# Altium project Pleiades_P01.PrjPcb (part 5 of 10)

## Sheet ADC.SchDoc
size 558 x 431 mm; SheetNumber: 11; SheetTotal: 25; Sheet_Name: ADC; Size: 11x17
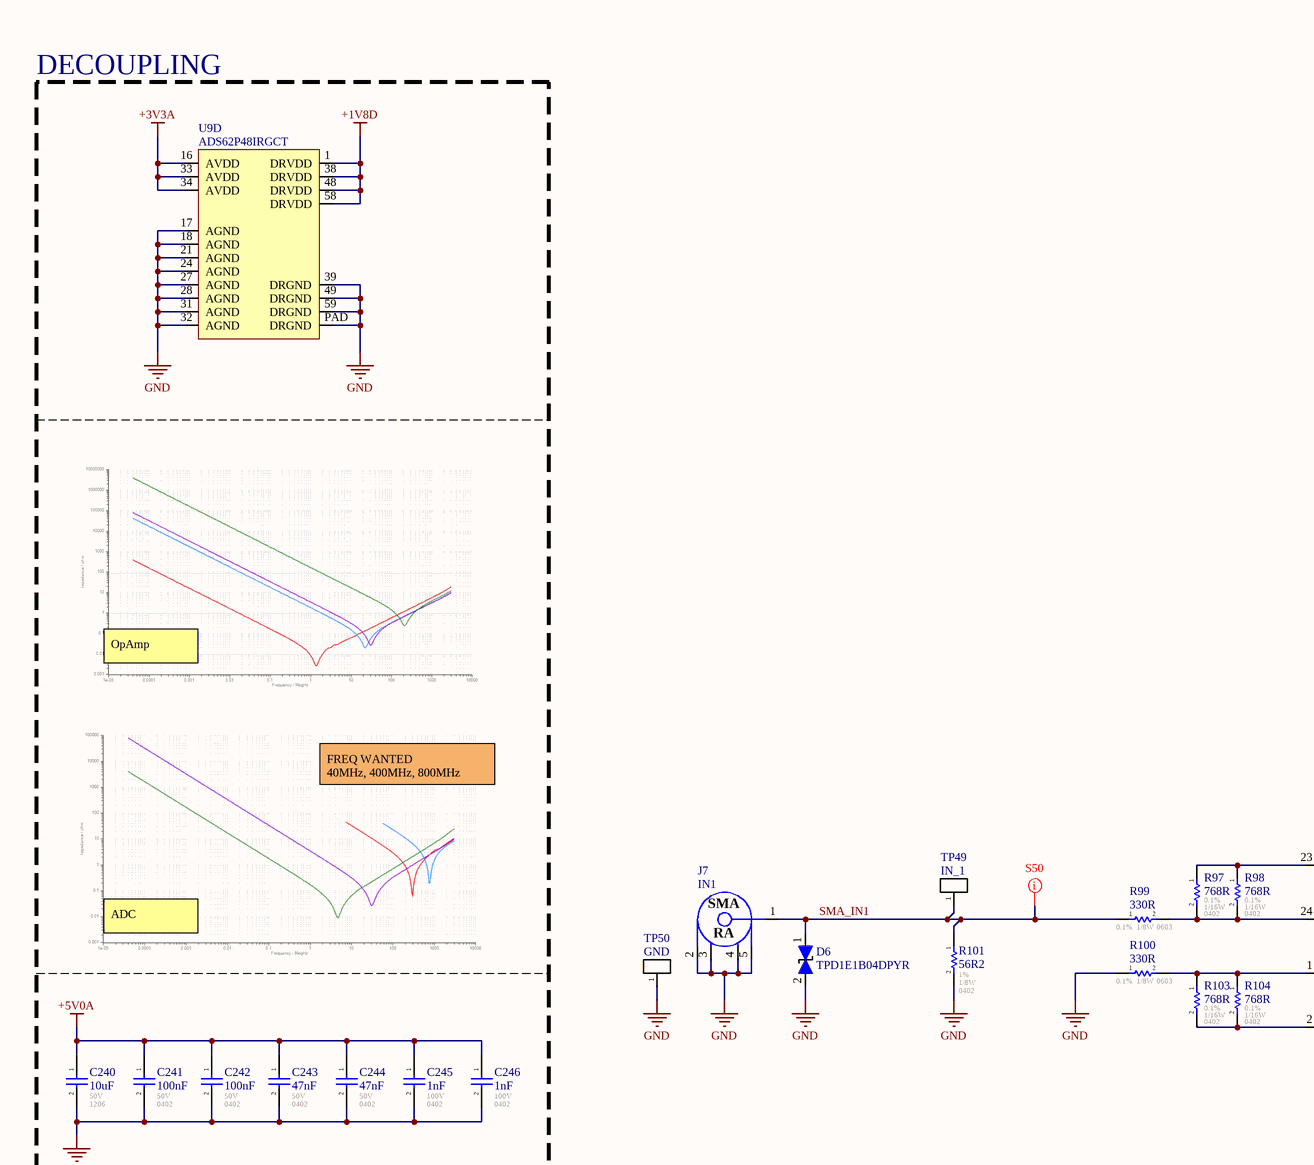
[diagram p26: ADC.SchDoc, top left]
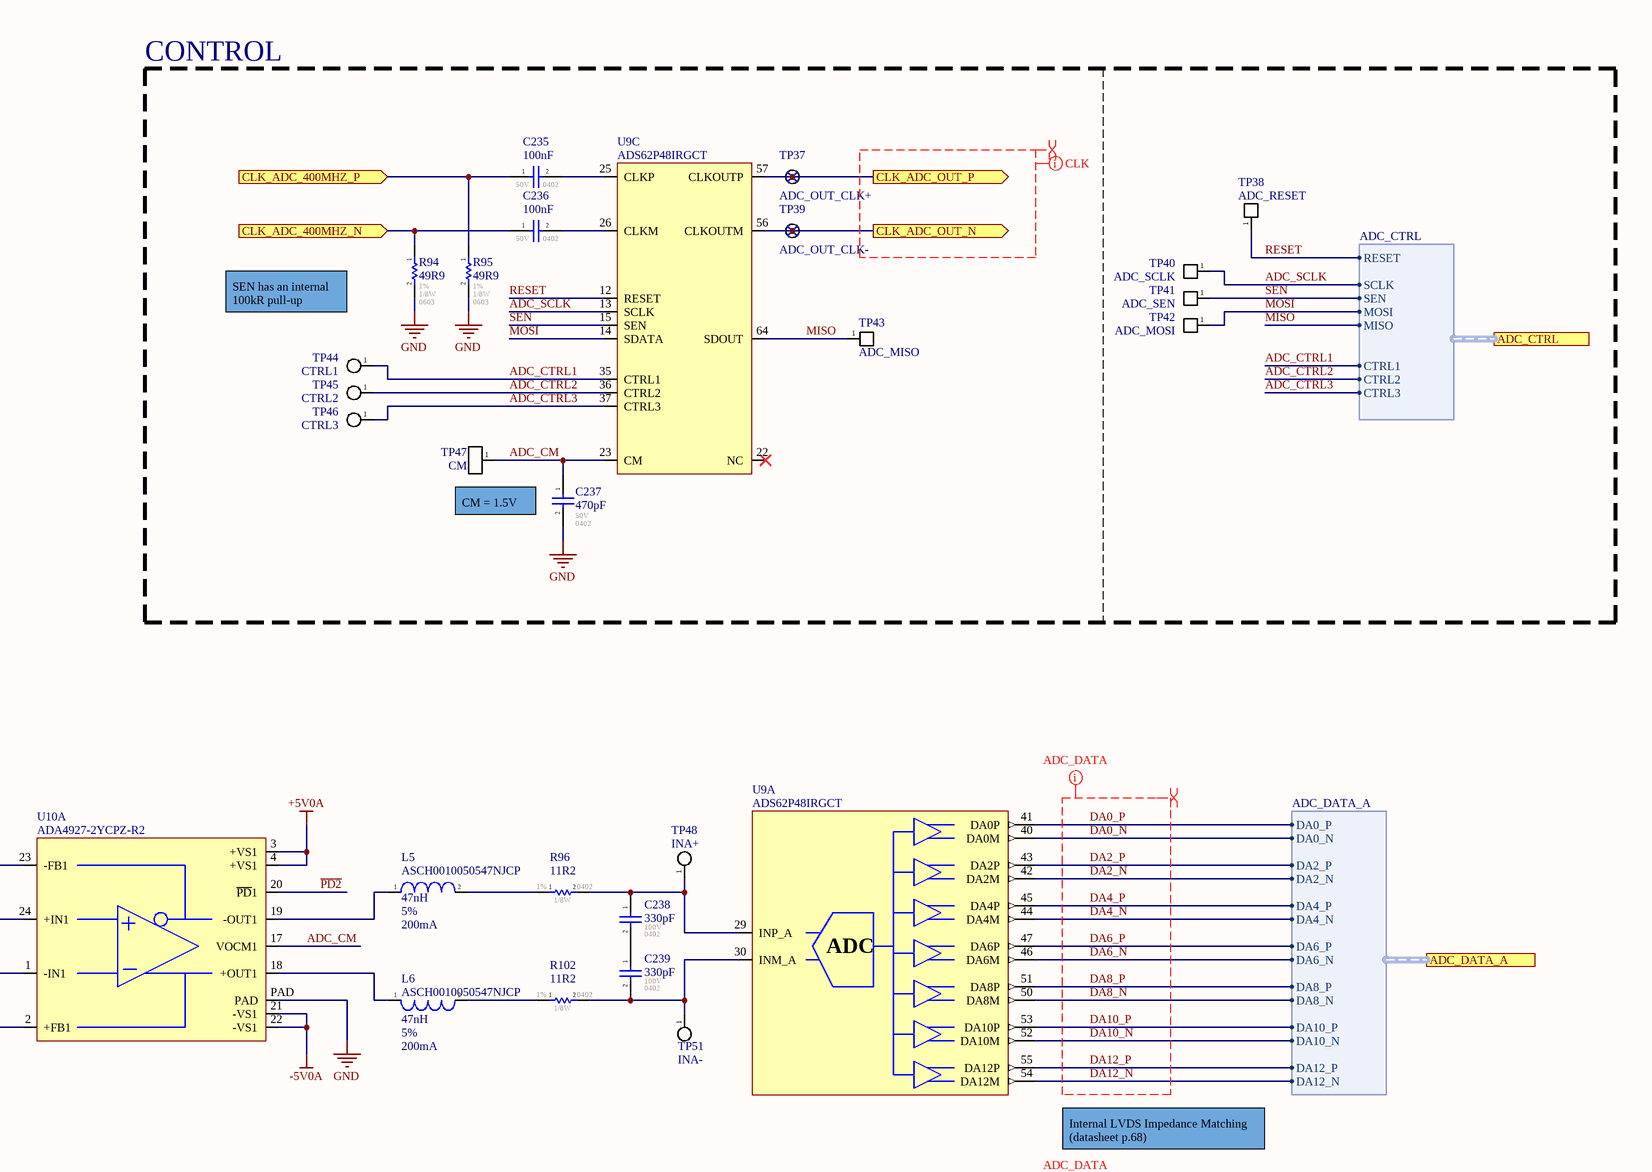
[diagram p27: ADC.SchDoc, top right]
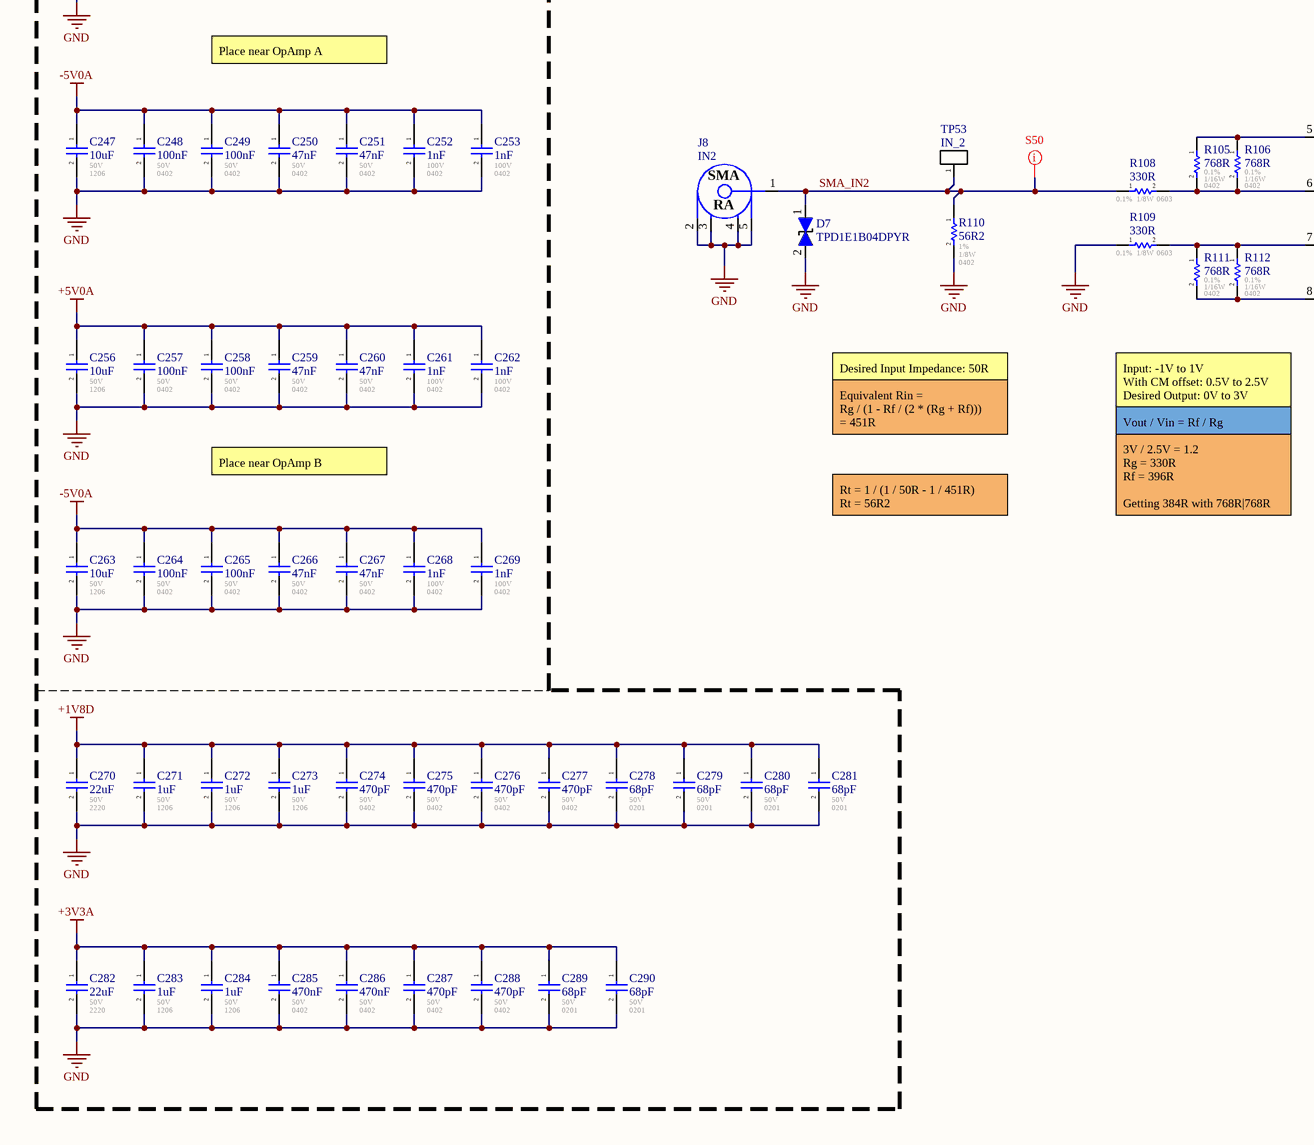
[diagram p28: ADC.SchDoc, bottom left]
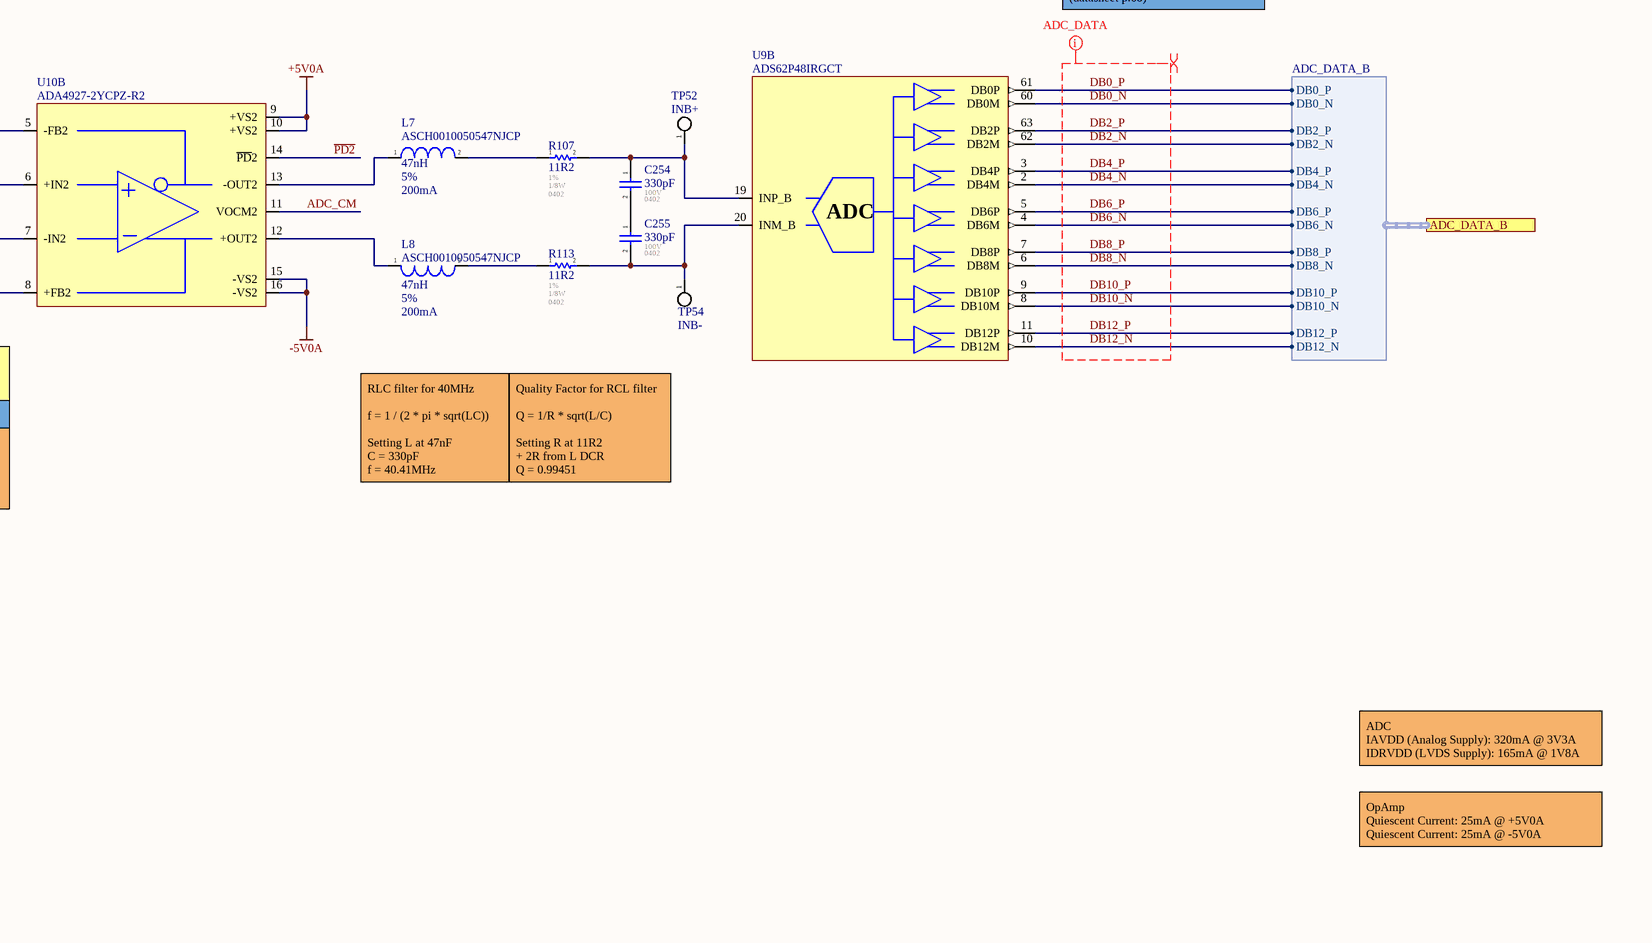
[diagram p29: ADC.SchDoc, bottom right]

### Parts
C235  100nF  Voltage - Rated: 50V  Footprint: 0402  [CAP_0402]
C236  100nF  Voltage - Rated: 50V  Footprint: 0402  [CAP_0402]
C237  470pF  Voltage - Rated: 50V  Footprint: 0402  [CAP_0402]
C238  330pF  Voltage - Rated: 100V  Footprint: 0402  [CAP_0402]
C239  330pF  Voltage - Rated: 100V  Footprint: 0402  [CAP_0402]
C240  10uF  Voltage - Rated: 50V  Footprint: 1206  [CAP_1206]
C241  100nF  Voltage - Rated: 50V  Footprint: 0402  [CAP_0402]
C242  100nF  Voltage - Rated: 50V  Footprint: 0402  [CAP_0402]
C243  47nF  Voltage - Rated: 50V  Footprint: 0402  [CAP_0402]
C244  47nF  Voltage - Rated: 50V  Footprint: 0402  [CAP_0402]
C245  1nF  Voltage - Rated: 100V  Footprint: 0402  [CAP_0402]
C246  1nF  Voltage - Rated: 100V  Footprint: 0402  [CAP_0402]
C247  10uF  Voltage - Rated: 50V  Footprint: 1206  [CAP_1206]
C248  100nF  Voltage - Rated: 50V  Footprint: 0402  [CAP_0402]
C249  100nF  Voltage - Rated: 50V  Footprint: 0402  [CAP_0402]
C250  47nF  Voltage - Rated: 50V  Footprint: 0402  [CAP_0402]
C251  47nF  Voltage - Rated: 50V  Footprint: 0402  [CAP_0402]
C252  1nF  Voltage - Rated: 100V  Footprint: 0402  [CAP_0402]
C253  1nF  Voltage - Rated: 100V  Footprint: 0402  [CAP_0402]
C254  330pF  Voltage - Rated: 100V  Footprint: 0402  [CAP_0402]
C255  330pF  Voltage - Rated: 100V  Footprint: 0402  [CAP_0402]
C256  10uF  Voltage - Rated: 50V  Footprint: 1206  [CAP_1206]
C257  100nF  Voltage - Rated: 50V  Footprint: 0402  [CAP_0402]
C258  100nF  Voltage - Rated: 50V  Footprint: 0402  [CAP_0402]
C259  47nF  Voltage - Rated: 50V  Footprint: 0402  [CAP_0402]
C260  47nF  Voltage - Rated: 50V  Footprint: 0402  [CAP_0402]
C261  1nF  Voltage - Rated: 100V  Footprint: 0402  [CAP_0402]
C262  1nF  Voltage - Rated: 100V  Footprint: 0402  [CAP_0402]
C263  10uF  Voltage - Rated: 50V  Footprint: 1206  [CAP_1206]
C264  100nF  Voltage - Rated: 50V  Footprint: 0402  [CAP_0402]
C265  100nF  Voltage - Rated: 50V  Footprint: 0402  [CAP_0402]
C266  47nF  Voltage - Rated: 50V  Footprint: 0402  [CAP_0402]
C267  47nF  Voltage - Rated: 50V  Footprint: 0402  [CAP_0402]
C268  1nF  Voltage - Rated: 100V  Footprint: 0402  [CAP_0402]
C269  1nF  Voltage - Rated: 100V  Footprint: 0402  [CAP_0402]
C270  22uF  Voltage - Rated: 50V  Footprint: 2220  [CAP_2220]
C271  1uF  Voltage - Rated: 50V  Footprint: 1206  [CAP_1206]
C272  1uF  Voltage - Rated: 50V  Footprint: 1206  [CAP_1206]
C273  1uF  Voltage - Rated: 50V  Footprint: 1206  [CAP_1206]
C274  470pF  Voltage - Rated: 50V  Footprint: 0402  [CAP_0402]
C275  470pF  Voltage - Rated: 50V  Footprint: 0402  [CAP_0402]
C276  470pF  Voltage - Rated: 50V  Footprint: 0402  [CAP_0402]
C277  470pF  Voltage - Rated: 50V  Footprint: 0402  [CAP_0402]
C278  68pF  Voltage - Rated: 50V  Footprint: 0201  [CAP_0402]
C279  68pF  Voltage - Rated: 50V  Footprint: 0201  [CAP_0402]
C280  68pF  Voltage - Rated: 50V  Footprint: 0201  [CAP_0402]
C281  68pF  Voltage - Rated: 50V  Footprint: 0201  [CAP_0402]
C282  22uF  Voltage - Rated: 50V  Footprint: 2220  [CAP_2220]
C283  1uF  Voltage - Rated: 50V  Footprint: 1206  [CAP_1206]
C284  1uF  Voltage - Rated: 50V  Footprint: 1206  [CAP_1206]
C285  470nF  Voltage - Rated: 50V  Footprint: 0402  [CAP_0402]
C286  470nF  Voltage - Rated: 50V  Footprint: 0402  [CAP_0402]
C287  470pF  Voltage - Rated: 50V  Footprint: 0402  [CAP_0402]
C288  470pF  Voltage - Rated: 50V  Footprint: 0402  [CAP_0402]
C289  68pF  Voltage - Rated: 50V  Footprint: 0201  [CAP_0402]
C290  68pF  Voltage - Rated: 50V  Footprint: 0201  [CAP_0402]
D6  TPD1E1B04DPYR  [TVS_DATA_TPD1E1B04DPYR]
D7  TPD1E1B04DPYR  [TVS_DATA_TPD1E1B04DPYR]
J7  IN1  [CONN_SMA_5-1814400-1]
J8  IN2  [CONN_SMA_5-1814400-1]
L5  ASCH0010050547NJCP  Inductance: 47nH  Tolerance: 5%  Current Rating: 200mA  [IND_0402]
L6  ASCH0010050547NJCP  Inductance: 47nH  Tolerance: 5%  Current Rating: 200mA  [IND_0402]
L7  ASCH0010050547NJCP  Inductance: 47nH  Tolerance: 5%  Current Rating: 200mA  [IND_0402]
L8  ASCH0010050547NJCP  Inductance: 47nH  Tolerance: 5%  Current Rating: 200mA  [IND_0402]
R94  49R9  Tolerance: 1%  Power: 1/8W  Package / Case: 0603  [RES_0603]
R95  49R9  Tolerance: 1%  Power: 1/8W  Package / Case: 0603  [RES_0603]
R96  11R2  Tolerance: 1%  Power: 1/8W  Package / Case: 0402  [RES_0402]
R97  768R  Tolerance: 0.1%  Power: 1/16W  Package / Case: 0402  [RES_0402]
R98  768R  Tolerance: 0.1%  Power: 1/16W  Package / Case: 0402  [RES_0402]
R99  330R  Tolerance: 0.1%  Power: 1/8W  Package / Case: 0603  [RES_0603]
R100  330R  Tolerance: 0.1%  Power: 1/8W  Package / Case: 0603  [RES_0603]
R101  56R2  Tolerance: 1%  Power: 1/8W  Package / Case: 0402  [RES_0402]
R102  11R2  Tolerance: 1%  Power: 1/8W  Package / Case: 0402  [RES_0402]
R103  768R  Tolerance: 0.1%  Power: 1/16W  Package / Case: 0402  [RES_0402]
R104  768R  Tolerance: 0.1%  Power: 1/16W  Package / Case: 0402  [RES_0402]
R105  768R  Tolerance: 0.1%  Power: 1/16W  Package / Case: 0402  [RES_0402]
R106  768R  Tolerance: 0.1%  Power: 1/16W  Package / Case: 0402  [RES_0402]
R107  11R2  Tolerance: 1%  Power: 1/8W  Package / Case: 0402  [RES_0402]
R108  330R  Tolerance: 0.1%  Power: 1/8W  Package / Case: 0603  [RES_0603]
R109  330R  Tolerance: 0.1%  Power: 1/8W  Package / Case: 0603  [RES_0603]
R110  56R2  Tolerance: 1%  Power: 1/8W  Package / Case: 0402  [RES_0402]
R111  768R  Tolerance: 0.1%  Power: 1/16W  Package / Case: 0402  [RES_0402]
R112  768R  Tolerance: 0.1%  Power: 1/16W  Package / Case: 0402  [RES_0402]
R113  11R2  Tolerance: 1%  Power: 1/8W  Package / Case: 0402  [RES_0402]
TP37  ADC_OUT_CLK+  [TP_PAD_TINY]  (no BOM)
TP38  ADC_RESET  [TP_PAD]  (no BOM)
TP39  ADC_OUT_CLK-  [TP_PAD_TINY]  (no BOM)
TP40  ADC_SCLK  [TP_PAD]  (no BOM)
TP41  ADC_SEN  [TP_PAD]  (no BOM)
TP42  ADC_MOSI  [TP_PAD]  (no BOM)
TP43  ADC_MISO  [TP_PAD]  (no BOM)
TP44  CTRL1  [TP_PAD_SMALL]  (no BOM)
TP45  CTRL2  [TP_PAD_SMALL]  (no BOM)
TP46  CTRL3  [TP_PAD_SMALL]  (no BOM)
TP47  CM  [TP_HOLE]  (no BOM)
TP48  INA+  [TP_PAD_SMALL]  (no BOM)
TP49  IN_1  [TP_HOLE]  (no BOM)
TP50  GND  [TP_HOLE]  (no BOM)
TP51  INA-  [TP_PAD_SMALL]  (no BOM)
TP52  INB+  [TP_PAD_SMALL]  (no BOM)
TP53  IN_2  [TP_HOLE]  (no BOM)
TP54  INB-  [TP_PAD_SMALL]  (no BOM)
U9  ADS62P48IRGCT  [ADC_ADS62P48IRGCT]  (parts A,B,C,D of 4)
U10  ADA4927-2YCPZ-R2  [OPAMP_ADA4927-2YCPZ-R2]  (parts A,B of 2)

### Blocks framed on the sheet
DECOUPLING: C240-C253 C256-C290 U9
CONTROL: C235-C237 R94 R95 TP37-TP47 U9

### Ports
ADC_CTRL (harness ADC_CTRL), ADC_DATA_A (harness ADC_DATA_A), ADC_DATA_B (harness ADC_DATA_B), CLK_ADC_400MHZ_N (in), CLK_ADC_400MHZ_P (in), CLK_ADC_OUT_N (out), CLK_ADC_OUT_P (out)

### Harnesses
ADC_DATA_A: DA0_P, DA0_N, DA2_P, DA2_N, DA4_P, DA4_N, DA6_P, DA6_N, DA8_P, DA8_N, DA10_P, DA10_N, DA12_P, DA12_N
ADC_DATA_B: DB0_P, DB0_N, DB2_P, DB2_N, DB4_P, DB4_N, DB6_P, DB6_N, DB8_P, DB8_N, DB10_P, DB10_N, DB12_P, DB12_N
ADC_CTRL: RESET, SCLK, SEN, MOSI, MISO, CTRL1, CTRL2, CTRL3

### Nets
+1V8D: C270.1 C271.1 C272.1 C273.1 C274.1 C275.1 C276.1 C277.1 C278.1 C279.1 C280.1 C281.1 U9.1(DRVDD) U9.38(DRVDD) U9.48(DRVDD) U9.58(DRVDD)
+3V3A: C282.1 C283.1 C284.1 C285.1 C286.1 C287.1 C288.1 C289.1 C290.1 U9.16(AVDD) U9.33(AVDD) U9.34(AVDD)
+5V0A: C240.1 C241.1 C242.1 C243.1 C244.1 C245.1 C246.1 C256.1 C257.1 C258.1 C259.1 C260.1 C261.1 C262.1 U10.3(+VS1) U10.4(+VS1) U10.9(+VS2) U10.10(+VS2)
-5V0A: C247.1 C248.1 C249.1 C250.1 C251.1 C252.1 C253.1 C263.1 C264.1 C265.1 C266.1 C267.1 C268.1 C269.1 U10.15(-VS2) U10.16(-VS2) U10.21(-VS1) U10.22(-VS1)
GND: C237.2 C240.2 C241.2 C242.2 C243.2 C244.2 C245.2 C246.2 C247.2 C248.2 C249.2 C250.2 C251.2 C252.2 C253.2 C256.2 C257.2 C258.2 C259.2 C260.2 C261.2 C262.2 C263.2 C264.2 C265.2 C266.2 C267.2 C268.2 C269.2 C270.2 C271.2 C272.2 C273.2 C274.2 C275.2 C276.2 C277.2 C278.2 C279.2 C280.2 C281.2 C282.2 C283.2 C284.2 C285.2 C286.2 C287.2 C288.2 C289.2 C290.2 D6.2(i/o) D7.2(i/o) J7.2 J7.3 J7.4 J7.5 J8.2 J8.3 J8.4 J8.5 R94.2 R95.2 R100.1 R101.2 R109.1 R110.2 TP50.1(A) U9.17(AGND) U9.18(AGND) U9.21(AGND) U9.24(AGND) U9.27(AGND) U9.28(AGND) U9.31(AGND) U9.32(AGND) U9.39(DRGND) U9.49(DRGND) U9.59(DRGND) U9.PAD(DRGND) U10.PAD
~{PD2}: U10.14(~{PD}2) U10.20(~{PD}1)  [project net ~{PD2_11}]
ADC_CM: C237.1 TP47.1(A) U9.23(CM) U10.11(VOCM2) U10.17(VOCM1)  [project net ADC_CM_11]
ADC_CTRL1: TP44.1(A) U9.35(CTRL1) ; port ADC_CTRL.CTRL1
ADC_CTRL2: TP45.1(A) U9.36(CTRL2) ; port ADC_CTRL.CTRL2
ADC_CTRL3: TP46.1(A) U9.37(CTRL3) ; port ADC_CTRL.CTRL3
ADC_SCLK: TP40.1(A) U9.13(SCLK) ; port ADC_CTRL.SCLK
CLK_ADC_400MHZ_N: C236.1 R94.1 ; port CLK_ADC_400MHZ_N
CLK_ADC_400MHZ_P: C235.1 R95.1 ; port CLK_ADC_400MHZ_P
CLK_ADC_OUT_N: TP39.1(A) U9.56(CLKOUTM) ; port CLK_ADC_OUT_N
CLK_ADC_OUT_P: TP37.1(A) U9.57(CLKOUTP) ; port CLK_ADC_OUT_P
DA0_N: U9.40(DA0M) ; port ADC_DATA_A.DA0_N
DA0_P: U9.41(DA0P) ; port ADC_DATA_A.DA0_P
DA2_N: U9.42(DA2M) ; port ADC_DATA_A.DA2_N
DA2_P: U9.43(DA2P) ; port ADC_DATA_A.DA2_P
DA4_N: U9.44(DA4M) ; port ADC_DATA_A.DA4_N
DA4_P: U9.45(DA4P) ; port ADC_DATA_A.DA4_P
DA6_N: U9.46(DA6M) ; port ADC_DATA_A.DA6_N
DA6_P: U9.47(DA6P) ; port ADC_DATA_A.DA6_P
DA8_N: U9.50(DA8M) ; port ADC_DATA_A.DA8_N
DA8_P: U9.51(DA8P) ; port ADC_DATA_A.DA8_P
DA10_N: U9.52(DA10M) ; port ADC_DATA_A.DA10_N
DA10_P: U9.53(DA10P) ; port ADC_DATA_A.DA10_P
DA12_N: U9.54(DA12M) ; port ADC_DATA_A.DA12_N
DA12_P: U9.55(DA12P) ; port ADC_DATA_A.DA12_P
DB0_N: U9.60(DB0M) ; port ADC_DATA_B.DB0_N
DB0_P: U9.61(DB0P) ; port ADC_DATA_B.DB0_P
DB2_N: U9.62(DB2M) ; port ADC_DATA_B.DB2_N
DB2_P: U9.63(DB2P) ; port ADC_DATA_B.DB2_P
DB4_N: U9.2(DB4M) ; port ADC_DATA_B.DB4_N
DB4_P: U9.3(DB4P) ; port ADC_DATA_B.DB4_P
DB6_N: U9.4(DB6M) ; port ADC_DATA_B.DB6_N
DB6_P: U9.5(DB6P) ; port ADC_DATA_B.DB6_P
DB8_N: U9.6(DB8M) ; port ADC_DATA_B.DB8_N
DB8_P: U9.7(DB8P) ; port ADC_DATA_B.DB8_P
DB10_N: U9.8(DB10M) ; port ADC_DATA_B.DB10_N
DB10_P: U9.9(DB10P) ; port ADC_DATA_B.DB10_P
DB12_N: U9.10(DB12M) ; port ADC_DATA_B.DB12_N
DB12_P: U9.11(DB12P) ; port ADC_DATA_B.DB12_P
MISO: TP43.1(A) U9.64(SDOUT) ; port ADC_CTRL.MISO
MOSI: TP42.1(A) U9.14(SDATA) ; port ADC_CTRL.MOSI
RESET: TP38.1(A) U9.12(RESET) ; port ADC_CTRL.RESET
SEN: TP41.1(A) U9.15(SEN) ; port ADC_CTRL.SEN
SMA_IN1: D6.1(i/o) J7.1 R99.1 R101.1 TP49.1(A)  [project net SMA_IN1_11]
SMA_IN2: D7.1(i/o) J8.1 R108.1 R110.1 TP53.1(A)  [project net SMA_IN2_11]
NetC235_2: C235.2 U9.25(CLKP)
NetC236_2: C236.2 U9.26(CLKM)
NetC238_1: C238.1 R96.2 TP48.1(A) U9.29(INP_A)
NetC238_2: C238.2 C239.1
NetC239_2: C239.2 R102.2 TP51.1(A) U9.30(INM_A)
NetC254_1: C254.1 R107.2 TP52.1(A) U9.19(INP_B)
NetC254_2: C254.2 C255.1
NetC255_2: C255.2 R113.2 TP54.1(A) U9.20(INM_B)
NetL5_1: L5.1 U10.19(-OUT1)
NetL5_2: L5.2 R96.1
NetL6_1: L6.1 U10.18(+OUT1)
NetL6_2: L6.2 R102.1
NetL7_1: L7.1 U10.13(-OUT2)
NetL7_2: L7.2 R107.1
NetL8_1: L8.1 U10.12(+OUT2)
NetL8_2: L8.2 R113.1
NetR97_1: R97.1 R98.1 U10.23(-FB1)
NetR97_2: R97.2 R98.2 R99.2 U10.24(+IN1)
NetR100_2: R100.2 R103.1 R104.1 U10.1(-IN1)
NetR103_2: R103.2 R104.2 U10.2(+FB1)
NetR105_1: R105.1 R106.1 U10.5(-FB2)
NetR105_2: R105.2 R106.2 R108.2 U10.6(+IN2)
NetR109_2: R109.2 R111.1 R112.1 U10.7(-IN2)
NetR111_2: R111.2 R112.2 U10.8(+FB2)

Not connected (* = marked no-connect by the designer): U9 22(NC)*

### Layout directives
net class CLK; net class ADC_DATA: (no net found under the mark)
differential pair: (no net found under the mark), DA0_N, DA0_P, DA2_N, DA2_P, DA4_N, DA4_P, DA6_N, DA6_P, DA8_N, DA8_P, DA10_N, DA10_P, DA12_N, DA12_P, DB0_N, DB0_P, DB2_N, DB2_P, DB4_N, DB4_P, DB6_N, DB6_P, DB8_N, DB8_P, DB10_N, DB10_P, DB12_N, DB12_P
net class S50: SMA_IN1_11, SMA_IN2_11
net class ADC_DATA: DA0_N, DA0_P, DA2_N, DA2_P, DA4_N, DA4_P, DA6_N, DA6_P, DA8_N, DA8_P, DA10_N, DA10_P, DA12_N, DA12_P, DB0_N, DB0_P, DB2_N, DB2_P, DB4_N, DB4_P, DB6_N, DB6_P, DB8_N, DB8_P, DB10_N, DB10_P, DB12_N, DB12_P

### Notes on the sheet
- SEN has an internal 100kR pull-up
- CM = 1.5V
- OpAmp
- FREQ WANTED
  40MHz, 400MHz, 800MHz
- ADC
- Internal LVDS Impedance Matching
  (datasheet p.68)
- Place near OpAmp A
- Desired Input Impedance: 50R
- Equivalent Rin =
  Rg / (1 - Rf / (2 * (Rg + Rf)))
  = 451R
- Input: -1V to 1V
  With CM offset: 0.5V to 2.5V
  Desired Output: 0V to 3V
- Vout / Vin = Rf / Rg
- Place near OpAmp B
- Rt = 1 / (1 / 50R - 1 / 451R)
  Rt = 56R2
- 3V / 2.5V = 1.2
  Rg = 330R
  Rf = 396R
  Getting 384R with 768R|768R
- RLC filter for 40MHz
  f = 1 / (2 * pi * sqrt(LC))
  Setting L at 47nF
  C = 330pF
  f = 40.41MHz
- Quality Factor for RCL filter
  Q = 1/R * sqrt(L/C)
  Setting R at 11R2
  + 2R from L DCR
  Q = 0.99451
- ADC
  IAVDD (Analog Supply): 320mA @ 3V3A
  IDRVDD (LVDS Supply): 165mA @ 1V8A
- OpAmp
  Quiescent Current: 25mA @ +5V0A
  Quiescent Current: 25mA @ -5V0A
- Sheet Name
- Project Title
- Global Project
- Revision
- Size
- Date
- Group
- Sheet
- of
- Filename
- Designers
- (in symbol ADC_ADS62P48IRGCT, part A) ADC
- (in symbol ADC_ADS62P48IRGCT, part B) ADC
- (in symbol CONN_SMA_5-1814400-1) SMA; RA

### Library data of the parts
C235 C236 C241 C242 C248 C249 C257 C258 C264 C265 = CAP_CER: GCM155R71H104KE02J / 0402 100nF 10% X7R Ceramic Capacitor; Mfr: Murata; Operating Temperature: -55C - 125C; Temperature Coefficient: X7R; ComponentLink1Description: Digikey; ComponentLink1URL: [Digikey Link]; Part#: GCM155R71H104KE02J; ComponentLink2Description: Datasheet; ComponentLink2URL: [Datasheet Link]; Tolerance: 10%; Ratings: AEC-Q200
C237 C274-C277 C287 C288 = CAP_CER: GCM155R71H471KA37J / 0402 470pF 10% X7R Ceramic Capacitor; Mfr: Murata; Operating Temperature: -55C - 125C; Temperature Coefficient: X7R; ComponentLink1Description: Digikey; ComponentLink1URL: https://www.digikey.ca/en/products/detail/murata-electronics/GCM155R71H471KA37J/2591324; Part#: GCM155R71H471KA37J; ComponentLink2Description: Datasheet; ComponentLink2URL: https://search.murata.co.jp/Ceramy/image/img/A01X/G101/ENG/GCM155R71H471KA37-01A.pdf; Tolerance: 10%; Ratings: AEC-Q200; ComponentLink3Description: Murata; ComponentLink3URL: https://www.murata.com/en-us/products/productdetail?partno=GCM155R71H471KA37%23; ComponentLink4Description: Octopart; ComponentLink4URL: https://octopart.com/gcm155r71h471ka37j-murata-17803389?r=sp
C238 C239 C254 C255 = CAP_CER: GCM155R72A331KA37D / 0402 330pF 10% X7R Ceramic Capacitor; Mfr: Murata; Operating Temperature: -55C - 125C; Temperature Coefficient: X7R; ComponentLink1Description: Digikey; ComponentLink1URL: https://www.digikey.ca/en/products/detail/murata-electronics/GCM155R72A331KA37D/2591348; Part#: GCM155R72A331KA37D; ComponentLink2Description: Datasheet; ComponentLink2URL: https://search.murata.co.jp/Ceramy/image/img/A01X/G101/ENG/GCM155R72A331KA37-01A.pdf; Tolerance: 10%; Ratings: AEC-Q200; ComponentLink3Description: Murata; ComponentLink3URL: https://www.murata.com/en-us/products/productdetail?partno=GCM155R72A331KA37%23; ComponentLink4Description: Octopart; ComponentLink4URL: https://octopart.com/gcm155r72a331ka37d-murata-18331888?r=sp; Supplier 1: Arrow Electronics; Supplier Part Number 1: GCM155R72A331KA37D
C240 C247 C256 C263 = CAP_CER: GRT31CR61H106KE01L / 1206 10uF 10% X5R Ceramic Capacitor; Mfr: Murata; Operating Temperature: -55C - 85C; Temperature Coefficient: X5R; ComponentLink1Description: Digikey; ComponentLink1URL: [Digikey Link]; ComponentLink2Description: Datasheet; ComponentLink2URL: [Datasheet Link]; Tolerance: 10%; Ratings: AEC-Q200; Supplier 1: Arrow Electronics; Supplier Part Number 1: GRT31CR61H106KE01L; Part#: GRT31CR61H106KE01L
C243 C244 C250 C251 C259 C260 C266 C267 = CAP_CER: GCM155R71H473KE02J / 0402 47nF 10% X7R Ceramic Capacitor; Mfr: Murata; Operating Temperature: -55C - 125C; Temperature Coefficient: X7R; ComponentLink1Description: Digikey; ComponentLink1URL: [Digikey Link]; Part#: GCM155R71H473KE02J; ComponentLink2Description: Datasheet; ComponentLink2URL: [Datasheet Link]; Tolerance: 10%; Ratings: AEC-Q200
C245 C246 C252 C253 C261 C262 C268 C269 = CAP_CER: as C206-C210 on sheet PROM; Operating Temperature: -55C - 125C; Temperature Coefficient: X7R; ComponentLink1Description: Digikey; ComponentLink1URL: [Digikey Link]; Part#: GCM155R72A102KA37D; ComponentLink2Description: Datasheet; ComponentLink2URL: [Datasheet Link]; Tolerance: 10%; Ratings: AEC-Q200
C270 C282 = CAP_CER: CGA9P3X7R1H226M250KB / 2220 22uF 20% X7R Ceramic Capacitor; Mfr: TDK; Operating Temperature: -55C - 125C; Temperature Coefficient: X7R; ComponentLink1Description: Digikey; ComponentLink1URL: https://www.digikey.ca/en/products/detail/tdk-corporation/CGA9P3X7R1H226M250KB/10240627; ComponentLink2Description: Datasheet; ComponentLink2URL: https://product.tdk.com/system/files/dam/doc/product/capacitor/ceramic/mlcc/charasheet/cga9p3x7r1h226m250kb.pdf; Tolerance: 20%; Ratings: AEC-Q200; Part#: CGA9P3X7R1H226M250KB; Supplier 1: Arrow Electronics; Supplier Part Number 1: CGA9P3X7R1H226M250KB; ComponentLink3Description: TDK; ComponentLink3URL: https://product.tdk.com/en/search/capacitor/ceramic/mlcc/info?part_no=CGA9P3X7R1H226M250KB; ComponentLink4Description: Octopart; ComponentLink4URL: https://octopart.com/cga9p3x7r1h226m250kb-tdk-102764996?r=sp
C271-C273 C283 C284 = CAP_CER: GCJ31CR71H105KA12L / 1206 1uF 10% X7R Ceramic Capacitor; Mfr: Murata; Operating Temperature: -55C - 125C; Temperature Coefficient: X7R; ComponentLink1Description: Digikey; ComponentLink1URL: [Digikey Link]; Part#: GCJ31CR71H105KA12L; ComponentLink2Description: Datasheet; ComponentLink2URL: [Datasheet Link]; Tolerance: 10%; Ratings: AEC-Q200
C278-C281 C289 C290 = CAP_CER: 0201 68pF 5% C0G 50V Ceramic Capacitor / CGA1A2C0G1H680J030BA; Mfr: TDK; Operating Temperature: -55C - 125C; Temperature Coefficient: C0G; ComponentLink1Description: Digikey; ComponentLink1URL: https://www.digikey.ca/en/products/detail/tdk-corporation/CGA1A2C0G1H680J030BA/3648597; Part#: CGA1A2C0G1H680J030BA; ComponentLink2Description: Datasheet; ComponentLink2URL: https://product.tdk.com/system/files/dam/doc/product/capacitor/ceramic/mlcc/charasheet/cga1a2c0g1h680j030ba.pdf; Tolerance: 5%; Ratings: AEC-Q200; ComponentLink3Description: Octopart; ComponentLink3URL: https://octopart.com/cga1a2c0g1h680j030ba-tdk-26014371?r=sp; ComponentLink4Description: TDK; ComponentLink4URL: https://product.tdk.com/en/search/capacitor/ceramic/mlcc/info?part_no=CGA1A2C0G1H680J030BA; Supplier 1: Arrow Electronics; Supplier Part Number 1: CGA1A2C0G1H680J030BA
C285 C286 = CAP_CER: CGA3E3X7R1H474K080AB / 0603 470nF 10% X7R Ceramic Capacitor; Mfr: TDK; Operating Temperature: -55C - 125C; Temperature Coefficient: X7R; ComponentLink1Description: Digikey; ComponentLink1URL: [Digikey Link]; Part#: CGA3E3X7R1H474K080AB; ComponentLink2Description: Datasheet; ComponentLink2URL: [Datasheet Link]; Tolerance: 10%; Ratings: AEC-Q200
D6 D7 = TVS_DATA_TPD1E1B04DPYR: TVS - TVS DIODE 3.6V 8.5V - 0402; Manufacturer #1: Texas Instruments; Current Rating: 6.3Apeak; Power Max: 50Wpeak; GRAMS Lib Spec: 2.8; Magnetic Material: Unknown; Polarized: No; Value: *; Tolerance: *; Voltage Rating: 3.6V; HelpURL: http://www.ti.com/lit/ds/symlink/tpd1e1b04.pdf; CreatedBy/Date: Keven Deslandes - 2018/10/19; VerifiedBy: Caroline Paulin - 28 janv 2019; Temperature: -40°C ~ 125°C (TA); Package: 0402; Manufacturer #2: *; Note: *; Assembly Type: SMD; Part Number #2: *; Part Number #1: TPD1E1B04DPYR; Supplier 1: Digi-Key; Supplier Part Number 1: 296-47364-1-ND; Cryo: UNKNOWN
J7 J8 = CONN_SMA_5-1814400-1: 5-1814400-1 / CONN -  SMA JACK R/A 50 OHM - TH; Mfg: TE Connectivity AMP Connectors; Voltage: *; Current: *; Power: *; Mfg Part Number: 5-1814400-1; HelpURL: http://www.te.com/commerce/DocumentDelivery/DDEController?Action=srchrtrv&DocNm=1814400&DocType=Customer+Drawing&DocLang=English; CreatedBy: Jonathan Bouchard; Temperature: -55°C ~ 85°C; Value: *; Precision: *; Package: TH-5; Supplier 1: Digikey; Supplier Part Number 1: A97593-ND
L5-L8 = INDUCTOR: Generic Inductor; Material: Ceramic; Resistance: 2R; Q @ Freq: 8 @ 100MHz; Operating Temperature: -40C - 125C; Package / Case: 0402; Ratings: AEC-Q200; ComponentLink1Description: Digikey; ComponentLink1URL: https://www.digikey.ca/en/products/detail/pulse-electronics/asch0010050547njcp/16505828; ComponentLink2Description: Datasheet; ComponentLink2URL: https://productfinder.pulseelectronics.com/api/open/part-attachments/datasheet/ASCH0010050547NJCP; ComponentLink3Description: Octopart; ComponentLink3URL: https://octopart.com/asch0010050547njcp-pulse-128075783?r=sp; Supplier 1: Mouser; Supplier Part Number 1: 673-ASCH10050547NJCP
R94-R98 R101-R107 R110-R113 = RESISTOR: Automotive: AEC-Q200; Operating Temperature: *; # Digikey: *; ComponentLink1Description: Digikey; ComponentLink1URL: *; # Manufacturer: *
R99 R100 R108 R109 = RESISTOR: 1M 0603 1% 1/16W Resistor; Automotive: AEC-Q200; Operating Temperature: *; # Digikey: *; ComponentLink1Description: Digikey; ComponentLink1URL: *; # Manufacturer: *
TP37 TP39 = TESTPOINT_PAD_TINY: Test Point
TP38 TP40-TP43 = TESTPOINT_PAD: Test Point
TP44-TP46 TP48 TP51 TP52 TP54 = TESTPOINT_PAD_SMALL: Test Point
TP47 TP49 TP50 TP53 = TESTPOINT: Test Point; ClassName: Testpoint
U9 = ADC_ADS62P48IRGCT: ADC - 14 BIT 210MSPS SUAL - VQFN-64; Voltage: 3.15 V ~ 3.6 V / 1.7 V ~ 1.9 V; Mfg: Texas Instruments; Precision: 14 Bit; Current: *; Power: *; Mfg Part Number: ADS62P48IRGCT; HelpURL: http://www.ti.com/lit/ds/symlink/ads62p48.pdf; CreatedBy: Jonathan Bouchard; Temperature: -40°C ~ 85°C; Value: *; Package: VQFN-64; Supplier 1: Digikey; Supplier Part Number 1: 296-24611-1-ND
U10 = OPAMP_ADA4927-2YCPZ-R2: OPAMP - CFA 2.3GHZ - QFN-24; Voltage: 4.5 V ~ 11 V, ±2.25 V ~ 5.5 V; Current: 65mA; Mfg: Analog Devices; Power: *; Mfg Part Number: ADA4927-2YCPZ-R2; HelpURL: http://www.analog.com/media/en/technical-documentation/data-sheets/ADA4927-1_4927-2.pdf; CreatedBy: Jonathan Bouchard; Temperature: -40°C ~ 105°C; Value: *; Precision: *; Package: QFN-24; Supplier 1: Digikey; Supplier Part Number 1: ADA4927-2YCPZ-R2CT-ND

## Sheet DAC.SchDoc
size 558 x 431 mm; SheetNumber: 12; SheetTotal: 25; Sheet_Name: DAC; Size: 11x17
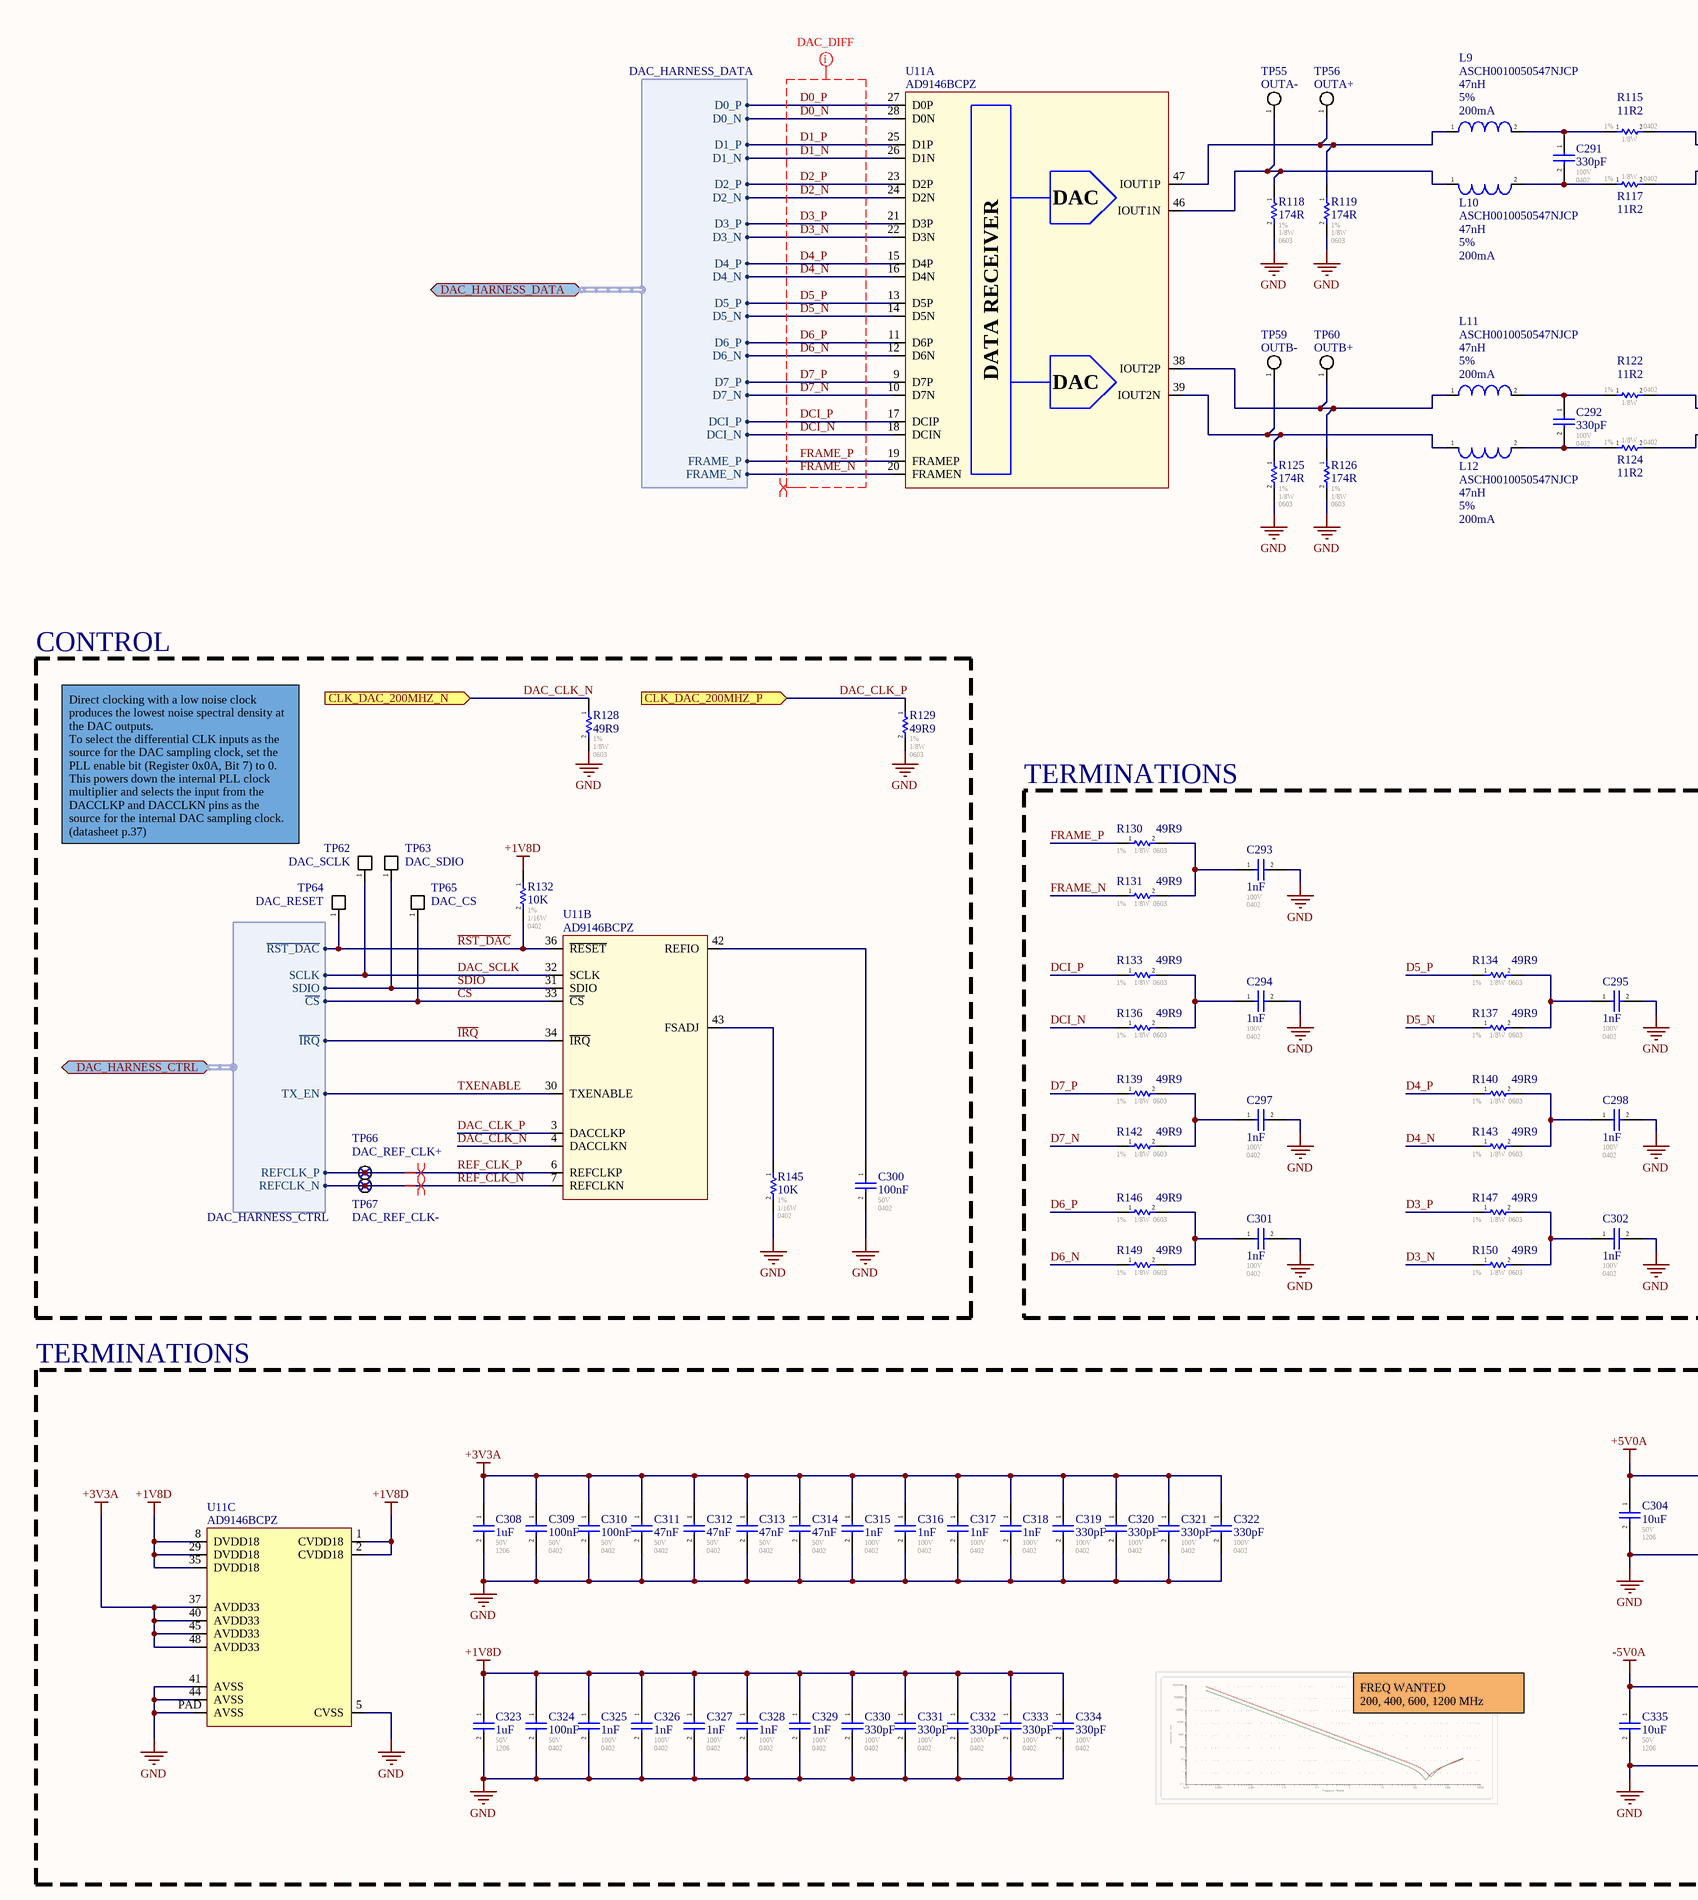
[diagram p30: DAC.SchDoc, left]
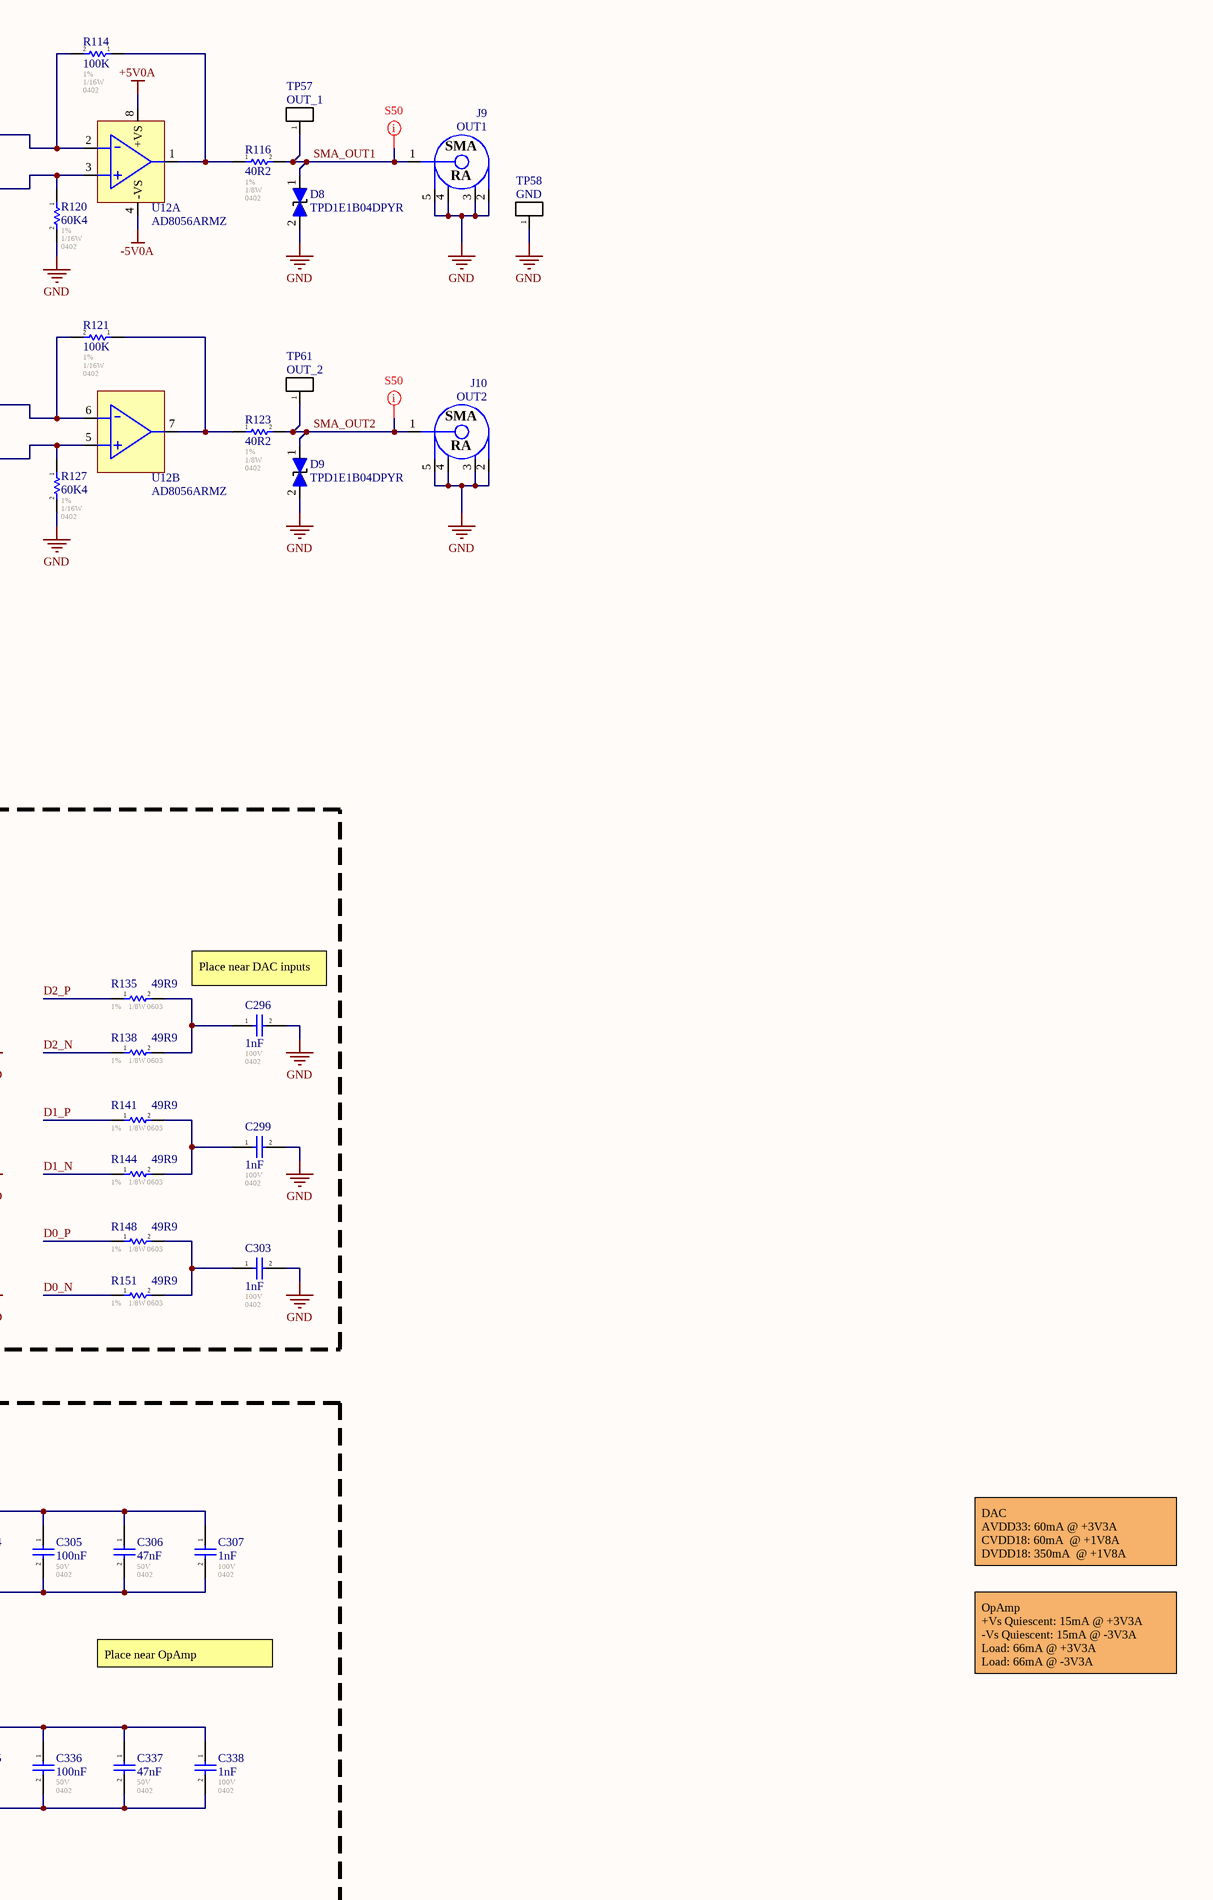
[diagram p31: DAC.SchDoc, right]

### Parts
C291  330pF  Voltage - Rated: 100V  Footprint: 0402  [CAP_0402]
C292  330pF  Voltage - Rated: 100V  Footprint: 0402  [CAP_0402]
C293  1nF  Voltage - Rated: 100V  Footprint: 0402  [CAP_0402]
C294  1nF  Voltage - Rated: 100V  Footprint: 0402  [CAP_0402]
C295  1nF  Voltage - Rated: 100V  Footprint: 0402  [CAP_0402]
C296  1nF  Voltage - Rated: 100V  Footprint: 0402  [CAP_0402]
C297  1nF  Voltage - Rated: 100V  Footprint: 0402  [CAP_0402]
C298  1nF  Voltage - Rated: 100V  Footprint: 0402  [CAP_0402]
C299  1nF  Voltage - Rated: 100V  Footprint: 0402  [CAP_0402]
C300  100nF  Voltage - Rated: 50V  Footprint: 0402  [CAP_0402]
C301  1nF  Voltage - Rated: 100V  Footprint: 0402  [CAP_0402]
C302  1nF  Voltage - Rated: 100V  Footprint: 0402  [CAP_0402]
C303  1nF  Voltage - Rated: 100V  Footprint: 0402  [CAP_0402]
C304  10uF  Voltage - Rated: 50V  Footprint: 1206  [CAP_1206]
C305  100nF  Voltage - Rated: 50V  Footprint: 0402  [CAP_0402]
C306  47nF  Voltage - Rated: 50V  Footprint: 0402  [CAP_0402]
C307  1nF  Voltage - Rated: 100V  Footprint: 0402  [CAP_0402]
C308  1uF  Voltage - Rated: 50V  Footprint: 1206  [CAP_1206]
C309  100nF  Voltage - Rated: 50V  Footprint: 0402  [CAP_0402]
C310  100nF  Voltage - Rated: 50V  Footprint: 0402  [CAP_0402]
C311  47nF  Voltage - Rated: 50V  Footprint: 0402  [CAP_0402]
C312  47nF  Voltage - Rated: 50V  Footprint: 0402  [CAP_0402]
C313  47nF  Voltage - Rated: 50V  Footprint: 0402  [CAP_0402]
C314  47nF  Voltage - Rated: 50V  Footprint: 0402  [CAP_0402]
C315  1nF  Voltage - Rated: 100V  Footprint: 0402  [CAP_0402]
C316  1nF  Voltage - Rated: 100V  Footprint: 0402  [CAP_0402]
C317  1nF  Voltage - Rated: 100V  Footprint: 0402  [CAP_0402]
C318  1nF  Voltage - Rated: 100V  Footprint: 0402  [CAP_0402]
C319  330pF  Voltage - Rated: 100V  Footprint: 0402  [CAP_0402]
C320  330pF  Voltage - Rated: 100V  Footprint: 0402  [CAP_0402]
C321  330pF  Voltage - Rated: 100V  Footprint: 0402  [CAP_0402]
C322  330pF  Voltage - Rated: 100V  Footprint: 0402  [CAP_0402]
C323  1uF  Voltage - Rated: 50V  Footprint: 1206  [CAP_1206]
C324  100nF  Voltage - Rated: 50V  Footprint: 0402  [CAP_0402]
C325  1nF  Voltage - Rated: 100V  Footprint: 0402  [CAP_0402]
C326  1nF  Voltage - Rated: 100V  Footprint: 0402  [CAP_0402]
C327  1nF  Voltage - Rated: 100V  Footprint: 0402  [CAP_0402]
C328  1nF  Voltage - Rated: 100V  Footprint: 0402  [CAP_0402]
C329  1nF  Voltage - Rated: 100V  Footprint: 0402  [CAP_0402]
C330  330pF  Voltage - Rated: 100V  Footprint: 0402  [CAP_0402]
C331  330pF  Voltage - Rated: 100V  Footprint: 0402  [CAP_0402]
C332  330pF  Voltage - Rated: 100V  Footprint: 0402  [CAP_0402]
C333  330pF  Voltage - Rated: 100V  Footprint: 0402  [CAP_0402]
C334  330pF  Voltage - Rated: 100V  Footprint: 0402  [CAP_0402]
C335  10uF  Voltage - Rated: 50V  Footprint: 1206  [CAP_1206]
C336  100nF  Voltage - Rated: 50V  Footprint: 0402  [CAP_0402]
C337  47nF  Voltage - Rated: 50V  Footprint: 0402  [CAP_0402]
C338  1nF  Voltage - Rated: 100V  Footprint: 0402  [CAP_0402]
D8  TPD1E1B04DPYR  [TVS_DATA_TPD1E1B04DPYR]
D9  TPD1E1B04DPYR  [TVS_DATA_TPD1E1B04DPYR]
J9  OUT1  [CONN_SMA_5-1814400-1]
J10  OUT2  [CONN_SMA_5-1814400-1]
L9  ASCH0010050547NJCP  Inductance: 47nH  Tolerance: 5%  Current Rating: 200mA  [IND_0402]
L10  ASCH0010050547NJCP  Inductance: 47nH  Tolerance: 5%  Current Rating: 200mA  [IND_0402]
L11  ASCH0010050547NJCP  Inductance: 47nH  Tolerance: 5%  Current Rating: 200mA  [IND_0402]
L12  ASCH0010050547NJCP  Inductance: 47nH  Tolerance: 5%  Current Rating: 200mA  [IND_0402]
R114  100K  Tolerance: 1%  Power: 1/16W  Package / Case: 0402  [RES_0402]
R115  11R2  Tolerance: 1%  Power: 1/8W  Package / Case: 0402  [RES_0402]
R116  40R2  Tolerance: 1%  Power: 1/8W  Package / Case: 0402  [RES_0402]
R117  11R2  Tolerance: 1%  Power: 1/8W  Package / Case: 0402  [RES_0402]
R118  174R  Tolerance: 1%  Power: 1/8W  Package / Case: 0603  [RES_0603]
R119  174R  Tolerance: 1%  Power: 1/8W  Package / Case: 0603  [RES_0603]
R120  60K4  Tolerance: 1%  Power: 1/16W  Package / Case: 0402  [RES_0402]
R121  100K  Tolerance: 1%  Power: 1/16W  Package / Case: 0402  [RES_0402]
R122  11R2  Tolerance: 1%  Power: 1/8W  Package / Case: 0402  [RES_0402]
R123  40R2  Tolerance: 1%  Power: 1/8W  Package / Case: 0402  [RES_0402]
R124  11R2  Tolerance: 1%  Power: 1/8W  Package / Case: 0402  [RES_0402]
R125  174R  Tolerance: 1%  Power: 1/8W  Package / Case: 0603  [RES_0603]
R126  174R  Tolerance: 1%  Power: 1/8W  Package / Case: 0603  [RES_0603]
R127  60K4  Tolerance: 1%  Power: 1/16W  Package / Case: 0402  [RES_0402]
R128  49R9  Tolerance: 1%  Power: 1/8W  Package / Case: 0603  [RES_0603]
R129  49R9  Tolerance: 1%  Power: 1/8W  Package / Case: 0603  [RES_0603]
R130  49R9  Tolerance: 1%  Power: 1/8W  Package / Case: 0603  [RES_0603]
R131  49R9  Tolerance: 1%  Power: 1/8W  Package / Case: 0603  [RES_0603]
R132  10K  Tolerance: 1%  Power: 1/16W  Package / Case: 0402  [RES_0402]
R133  49R9  Tolerance: 1%  Power: 1/8W  Package / Case: 0603  [RES_0603]
R134  49R9  Tolerance: 1%  Power: 1/8W  Package / Case: 0603  [RES_0603]
R135  49R9  Tolerance: 1%  Power: 1/8W  Package / Case: 0603  [RES_0603]
R136  49R9  Tolerance: 1%  Power: 1/8W  Package / Case: 0603  [RES_0603]
R137  49R9  Tolerance: 1%  Power: 1/8W  Package / Case: 0603  [RES_0603]
R138  49R9  Tolerance: 1%  Power: 1/8W  Package / Case: 0603  [RES_0603]
R139  49R9  Tolerance: 1%  Power: 1/8W  Package / Case: 0603  [RES_0603]
R140  49R9  Tolerance: 1%  Power: 1/8W  Package / Case: 0603  [RES_0603]
R141  49R9  Tolerance: 1%  Power: 1/8W  Package / Case: 0603  [RES_0603]
R142  49R9  Tolerance: 1%  Power: 1/8W  Package / Case: 0603  [RES_0603]
R143  49R9  Tolerance: 1%  Power: 1/8W  Package / Case: 0603  [RES_0603]
R144  49R9  Tolerance: 1%  Power: 1/8W  Package / Case: 0603  [RES_0603]
R145  10K  Tolerance: 1%  Power: 1/16W  Package / Case: 0402  [RES_0402]
R146  49R9  Tolerance: 1%  Power: 1/8W  Package / Case: 0603  [RES_0603]
R147  49R9  Tolerance: 1%  Power: 1/8W  Package / Case: 0603  [RES_0603]
R148  49R9  Tolerance: 1%  Power: 1/8W  Package / Case: 0603  [RES_0603]
R149  49R9  Tolerance: 1%  Power: 1/8W  Package / Case: 0603  [RES_0603]
R150  49R9  Tolerance: 1%  Power: 1/8W  Package / Case: 0603  [RES_0603]
R151  49R9  Tolerance: 1%  Power: 1/8W  Package / Case: 0603  [RES_0603]
TP55  OUTA-  [TP_PAD_SMALL]  (no BOM)
TP56  OUTA+  [TP_PAD_SMALL]  (no BOM)
TP57  OUT_1  [TP_HOLE]  (no BOM)
TP58  GND  [TP_HOLE]  (no BOM)
TP59  OUTB-  [TP_PAD_SMALL]  (no BOM)
TP60  OUTB+  [TP_PAD_SMALL]  (no BOM)
TP61  OUT_2  [TP_HOLE]  (no BOM)
TP62  DAC_SCLK  [TP_PAD]  (no BOM)
TP63  DAC_SDIO  [TP_PAD]  (no BOM)
TP64  DAC_RESET  [TP_PAD]  (no BOM)
TP65  DAC_CS  [TP_PAD]  (no BOM)
TP66  DAC_REF_CLK+  [TP_PAD_TINY]  (no BOM)
TP67  DAC_REF_CLK-  [TP_PAD_TINY]  (no BOM)
U11  AD9146BCPZ  [DAC_AD9146BCPZ]  (parts A,B,C of 3)
U12  AD8056ARMZ  [OPAMP_AD8056ARMZ]  (parts A,B of 2)

### Blocks framed on the sheet
CONTROL: C300 R128 R129 R132 R145 TP62-TP67 U11
TERMINATIONS: C293-C299 C301-C303 R130 R131 R133-R144 R146-R151
TERMINATIONS: C304-C338 U11

### Ports
CLK_DAC_200MHZ_N (in), CLK_DAC_200MHZ_P (in), DAC_HARNESS_CTRL (bidir, harness DAC_HARNESS_CTRL), DAC_HARNESS_DATA (bidir, harness DAC_HARNESS_DATA)

### Harnesses
DAC_HARNESS_DATA: D0_N, D0_P, D1_P, D1_N, D2_P, D2_N, D3_P, D3_N, D4_P, D4_N, D5_P, D5_N, D6_P, D6_N, D7_P, D7_N, DCI_P, DCI_N, FRAME_P, FRAME_N
DAC_HARNESS_CTRL: ~{RST_DAC}, SCLK, SDIO, ~{CS}, ~{IRQ}, TX_EN, REFCLK_P, REFCLK_N

### Nets
+1V8D: C323.1 C324.1 C325.1 C326.1 C327.1 C328.1 C329.1 C330.1 C331.1 C332.1 C333.1 C334.1 R132.1 U11.1(CVDD18) U11.2(CVDD18) U11.8(DVDD18) U11.29(DVDD18) U11.35(DVDD18)
+3V3A: C308.1 C309.1 C310.1 C311.1 C312.1 C313.1 C314.1 C315.1 C316.1 C317.1 C318.1 C319.1 C320.1 C321.1 C322.1 U11.37(AVDD33) U11.40(AVDD33) U11.45(AVDD33) U11.48(AVDD33)
+5V0A: C304.1 C305.1 C306.1 C307.1 U12.8(+VS)
-5V0A: C335.1 C336.1 C337.1 C338.1 U12.4(-VS)
GND: C293.2 C294.2 C295.2 C296.2 C297.2 C298.2 C299.2 C300.2 C301.2 C302.2 C303.2 C304.2 C305.2 C306.2 C307.2 C308.2 C309.2 C310.2 C311.2 C312.2 C313.2 C314.2 C315.2 C316.2 C317.2 C318.2 C319.2 C320.2 C321.2 C322.2 C323.2 C324.2 C325.2 C326.2 C327.2 C328.2 C329.2 C330.2 C331.2 C332.2 C333.2 C334.2 C335.2 C336.2 C337.2 C338.2 D8.2(i/o) D9.2(i/o) J9.2 J9.3 J9.4 J9.5 J10.2 J10.3 J10.4 J10.5 R118.2 R119.2 R120.2 R125.2 R126.2 R127.2 R128.2 R129.2 R145.2 TP58.1(A) U11.5(CVSS) U11.41(AVSS) U11.44(AVSS) U11.PAD(AVSS)
~{CS}: TP65.1(A) U11.33(~{CS}) ; port DAC_HARNESS_CTRL.~{CS}
~{IRQ}: U11.34(~{IRQ}) ; port DAC_HARNESS_CTRL.~{IRQ}
~{RST_DAC}: R132.2 TP64.1(A) U11.36(~{RESET}) ; port DAC_HARNESS_CTRL.~{RST_DAC}
D0_N: R151.1 U11.28(D0N) ; port DAC_HARNESS_DATA.D0_N
D0_P: R148.1 U11.27(D0P) ; port DAC_HARNESS_DATA.D0_P
D1_N: R144.1 U11.26(D1N) ; port DAC_HARNESS_DATA.D1_N
D1_P: R141.1 U11.25(D1P) ; port DAC_HARNESS_DATA.D1_P
D2_N: R138.1 U11.24(D2N) ; port DAC_HARNESS_DATA.D2_N
D2_P: R135.1 U11.23(D2P) ; port DAC_HARNESS_DATA.D2_P
D3_N: R150.1 U11.22(D3N) ; port DAC_HARNESS_DATA.D3_N
D3_P: R147.1 U11.21(D3P) ; port DAC_HARNESS_DATA.D3_P
D4_N: R143.1 U11.16(D4N) ; port DAC_HARNESS_DATA.D4_N
D4_P: R140.1 U11.15(D4P) ; port DAC_HARNESS_DATA.D4_P
D5_N: R137.1 U11.14(D5N) ; port DAC_HARNESS_DATA.D5_N
D5_P: R134.1 U11.13(D5P) ; port DAC_HARNESS_DATA.D5_P
D6_N: R149.1 U11.12(D6N) ; port DAC_HARNESS_DATA.D6_N
D6_P: R146.1 U11.11(D6P) ; port DAC_HARNESS_DATA.D6_P
D7_N: R142.1 U11.10(D7N) ; port DAC_HARNESS_DATA.D7_N
D7_P: R139.1 U11.9(D7P) ; port DAC_HARNESS_DATA.D7_P
DAC_CLK_N: R128.1 U11.4(DACCLKN) ; port CLK_DAC_200MHZ_N  [project net CLK_DAC_200MHZ_N]
DAC_CLK_P: R129.1 U11.3(DACCLKP) ; port CLK_DAC_200MHZ_P  [project net CLK_DAC_200MHZ_P]
DAC_SCLK: TP62.1(A) U11.32(SCLK) ; port DAC_HARNESS_CTRL.SCLK
DCI_N: R136.1 U11.18(DCIN) ; port DAC_HARNESS_DATA.DCI_N
DCI_P: R133.1 U11.17(DCIP) ; port DAC_HARNESS_DATA.DCI_P
FRAME_N: R131.1 U11.20(FRAMEN) ; port DAC_HARNESS_DATA.FRAME_N
FRAME_P: R130.1 U11.19(FRAMEP) ; port DAC_HARNESS_DATA.FRAME_P
REF_CLK_N: TP67.1(A) U11.7(REFCLKN) ; port DAC_HARNESS_CTRL.REFCLK_N
REF_CLK_P: TP66.1(A) U11.6(REFCLKP) ; port DAC_HARNESS_CTRL.REFCLK_P
SDIO: TP63.1(A) U11.31(SDIO) ; port DAC_HARNESS_CTRL.SDIO
SMA_OUT1: D8.1(i/o) J9.1 R116.2 TP57.1(A)  [project net SMA_OUT1_12]
SMA_OUT2: D9.1(i/o) J10.1 R123.2 TP61.1(A)  [project net SMA_OUT2_12]
TXENABLE: U11.30(TXENABLE) ; port DAC_HARNESS_CTRL.TX_EN
NetC291_1: C291.1 L9.2 R115.1
NetC291_2: C291.2 L10.2 R117.1
NetC292_1: C292.1 L11.2 R122.1
NetC292_2: C292.2 L12.2 R124.1
NetC293_1: C293.1 R130.2 R131.2
NetC294_1: C294.1 R133.2 R136.2
NetC295_1: C295.1 R134.2 R137.2
NetC296_1: C296.1 R135.2 R138.2
NetC297_1: C297.1 R139.2 R142.2
NetC298_1: C298.1 R140.2 R143.2
NetC299_1: C299.1 R141.2 R144.2
NetC300_1: C300.1 U11.42(REFIO)
NetC301_1: C301.1 R146.2 R149.2
NetC302_1: C302.1 R147.2 R150.2
NetC303_1: C303.1 R148.2 R151.2
NetL9_1: L9.1 R119.1 TP56.1(A) U11.47(IOUT1P)
NetL10_1: L10.1 R118.1 TP55.1(A) U11.46(IOUT1N)
NetL11_1: L11.1 R126.1 TP60.1(A) U11.38(IOUT2P)
NetL12_1: L12.1 R125.1 TP59.1(A) U11.39(IOUT2N)
NetR114_1: R114.1 R116.1 U12.1(OUT1)
NetR114_2: R114.2 R115.2 U12.2(-IN1)
NetR117_2: R117.2 R120.1 U12.3(+IN1)
NetR121_1: R121.1 R123.1 U12.7(OUT2)
NetR121_2: R121.2 R122.2 U12.6(-IN2)
NetR124_2: R124.2 R127.1 U12.5(+IN2)
NetR145_1: R145.1 U11.43(FSADJ)

### Layout directives
net class DAC_DIFF: D0_N, D0_P, D1_N, D1_P, D2_N, D2_P, D3_N, D3_P, D4_N, D4_P, D5_N, D5_P, D6_N, D6_P, D7_N, D7_P, DCI_N, DCI_P, FRAME_N, FRAME_P
differential pair: D0_N, D0_P, D1_N, D1_P, D2_N, D2_P, D3_N, D3_P, D4_N, D4_P, D5_N, D5_P, D6_N, D6_P, D7_N, D7_P, DCI_N, DCI_P, FRAME_N, FRAME_P, REF_CLK_N, REF_CLK_P
net class S50: SMA_OUT1_12, SMA_OUT2_12

### Notes on the sheet
- Direct clocking with a low noise clock produces the lowest noise spectral density at the DAC outputs.
  To select the differential CLK inputs as the source for the DAC sampling clock, set the PLL enable bit (Register 0x0A, Bit 7) to 0. This powers down the internal PLL clock multiplier and selects the input from the DACCLKP and DACCLKN pins as the source for the internal DAC sampling clock.
  (datasheet p.37)
- Place near DAC inputs
- DAC
  AVDD33: 60mA @ +3V3A
  CVDD18: 60mA  @ +1V8A
  DVDD18: 350mA  @ +1V8A
- Place near OpAmp
- OpAmp
  +Vs Quiescent: 15mA @ +3V3A
  -Vs Quiescent: 15mA @ -3V3A
  Load: 66mA @ +3V3A
  Load: 66mA @ -3V3A
- FREQ WANTED
  200, 400, 600, 1200 MHz
- Sheet Name
- Project Title
- Global Project
- Revision
- Size
- Date
- Group
- Sheet
- of
- Filename
- Designers
- (in symbol CONN_SMA_5-1814400-1) SMA; RA
- (in symbol DAC_AD9146BCPZ, part A) DAC; DATA RECEIVER

### Library data of the parts
C291 C292 C319-C322 C330-C334 = CAP_CER: as C238 on sheet ADC; Operating Temperature: -55C - 125C; Temperature Coefficient: X7R; ComponentLink1Description: Digikey; ComponentLink1URL: https://www.digikey.ca/en/products/detail/murata-electronics/GCM155R72A331KA37D/2591348; Part#: GCM155R72A331KA37D; ComponentLink2Description: Datasheet; ComponentLink2URL: https://search.murata.co.jp/Ceramy/image/img/A01X/G101/ENG/GCM155R72A331KA37-01A.pdf; Tolerance: 10%; Ratings: AEC-Q200; ComponentLink3Description: Murata; ComponentLink3URL: https://www.murata.com/en-us/products/productdetail?partno=GCM155R72A331KA37%23; ComponentLink4Description: Octopart; ComponentLink4URL: https://octopart.com/gcm155r72a331ka37d-murata-18331888?r=sp; Supplier 1: Arrow Electronics; Supplier Part Number 1: GCM155R72A331KA37D
C293-C299 C301-C303 C307 C315-C318 C325-C329 C338 = CAP_CER: as C206-C210 on sheet PROM; Operating Temperature: -55C - 125C; Temperature Coefficient: X7R; ComponentLink1Description: Digikey; ComponentLink1URL: [Digikey Link]; Part#: GCM155R72A102KA37D; ComponentLink2Description: Datasheet; ComponentLink2URL: [Datasheet Link]; Tolerance: 10%; Ratings: AEC-Q200
C300 C305 C309 C310 C324 C336 = CAP_CER: as C235 on sheet ADC; Operating Temperature: -55C - 125C; Temperature Coefficient: X7R; ComponentLink1Description: Digikey; ComponentLink1URL: [Digikey Link]; Part#: GCM155R71H104KE02J; ComponentLink2Description: Datasheet; ComponentLink2URL: [Datasheet Link]; Tolerance: 10%; Ratings: AEC-Q200
C304 C335 = CAP_CER: as C240 on sheet ADC; Operating Temperature: -55C - 85C; Temperature Coefficient: X5R; ComponentLink1Description: Digikey; ComponentLink1URL: [Digikey Link]; ComponentLink2Description: Datasheet; ComponentLink2URL: [Datasheet Link]; Tolerance: 10%; Ratings: AEC-Q200; Supplier 1: Arrow Electronics; Supplier Part Number 1: GRT31CR61H106KE01L; Part#: GRT31CR61H106KE01L
C306 C311-C314 C337 = CAP_CER: as C243 on sheet ADC; Operating Temperature: -55C - 125C; Temperature Coefficient: X7R; ComponentLink1Description: Digikey; ComponentLink1URL: [Digikey Link]; Part#: GCM155R71H473KE02J; ComponentLink2Description: Datasheet; ComponentLink2URL: [Datasheet Link]; Tolerance: 10%; Ratings: AEC-Q200
C308 C323 = CAP_CER: as C271 on sheet ADC; Operating Temperature: -55C - 125C; Temperature Coefficient: X7R; ComponentLink1Description: Digikey; ComponentLink1URL: [Digikey Link]; Part#: GCJ31CR71H105KA12L; ComponentLink2Description: Datasheet; ComponentLink2URL: [Datasheet Link]; Tolerance: 10%; Ratings: AEC-Q200
D8 D9 = TVS_DATA_TPD1E1B04DPYR: as D6 on sheet ADC; Value: *; Tolerance: *; Voltage Rating: 3.6V; HelpURL: http://www.ti.com/lit/ds/symlink/tpd1e1b04.pdf; CreatedBy/Date: Keven Deslandes - 2018/10/19; VerifiedBy: Caroline Paulin - 28 janv 2019; Temperature: -40°C ~ 125°C (TA); Package: 0402; Manufacturer #2: *; Note: *; Assembly Type: SMD; Part Number #2: *; Part Number #1: TPD1E1B04DPYR; Supplier 1: Digi-Key; Supplier Part Number 1: 296-47364-1-ND; Cryo: UNKNOWN
J9 J10 = CONN_SMA_5-1814400-1: as J7 on sheet ADC; Voltage: *; Current: *; Power: *; Mfg Part Number: 5-1814400-1; HelpURL: http://www.te.com/commerce/DocumentDelivery/DDEController?Action=srchrtrv&DocNm=1814400&DocType=Customer+Drawing&DocLang=English; CreatedBy: Jonathan Bouchard; Temperature: -55°C ~ 85°C; Value: *; Precision: *; Package: TH-5; Supplier 1: Digikey; Supplier Part Number 1: A97593-ND
L9-L12 = INDUCTOR: as L5 on sheet ADC; Operating Temperature: -40C - 125C; Package / Case: 0402; Ratings: AEC-Q200; ComponentLink1Description: Digikey; ComponentLink1URL: https://www.digikey.ca/en/products/detail/pulse-electronics/asch00100505r10jcp/16503422; ComponentLink2Description: Datasheet; ComponentLink2URL: https://productfinder.pulseelectronics.com/api/open/part-attachments/datasheet/ASCH0010050547NJCP; ComponentLink3Description: Octopart; ComponentLink3URL: https://octopart.com/asch00100505r10jcp-pulse-128075794?r=sp; Supplier 1: Digikey; Supplier Part Number 1: 553-ASCH00100505R10JCPTR-ND
R114-R119 R121-R126 R128-R151 = RESISTOR: Automotive: AEC-Q200; Operating Temperature: *; # Digikey: *; ComponentLink1Description: Digikey; ComponentLink1URL: *; # Manufacturer: *
R120 R127 = RESISTOR: RMCF0402FT60K4; Automotive: AEC-Q200; Operating Temperature: *; # Digikey: *; ComponentLink1Description: Digikey; ComponentLink1URL: *; # Manufacturer: *
TP55 TP56 TP59 TP60 = TESTPOINT_PAD_SMALL: Test Point
TP57 TP58 TP61 = TESTPOINT: Test Point; ClassName: Testpoint
TP62-TP65 = TESTPOINT_PAD: Test Point
TP66 TP67 = TESTPOINT_PAD_TINY: Test Point
U11 = DAC_AD9146BCPZ: DAC - 16BIT SRL HIGH SPEED - QFN-48; Voltage: 3.13 V ~ 3.47 V / 1.71 V ~ 1.89 V; Mfg: Analog Devices Inc.; Current: *; Power: *; Mfg Part Number: AD9146BCPZ; HelpURL: http://www.analog.com/media/en/technical-documentation/data-sheets/AD9146.PDF; CreatedBy: Jonathan Bouchard; Temperature: -40°C ~ 85°C; Value: *; Precision: 16 Bit; Package: QFN-48; Supplier 1: Digikey; Supplier Part Number 1: AD9146BCPZ-ND
U12 = OPAMP_AD8056ARMZ: OPAMP - VFB 300MHZ - 8MSOP; Voltage: 8 V ~ 12 V, ±4 V ~ 6 V; Current: 60mA; Mfg: Analog Devices; Power: *; Mfg Part Number: AD8056ARMZ; HelpURL: http://www.analog.com/media/en/technical-documentation/data-sheets/AD8055_8056.pdf; CreatedBy: Jonathan Bouchard; Temperature: -40°C ~ 125°C; Value: *; Precision: *; Package: MSOP-8; Supplier 1: Digikey; Supplier Part Number 1: AD8056ARMZ-REEL7CT-ND